# Altium schematic sheet SME_Main.SchDoc: Titulo
size OrCAD A; Author: Ismael Poblete V.; CompanyName: SME; Organization: SME; Address1: Santiago, Chile; DocumentNumber: SME-UNO; Revision: 1.0; SheetNumber: 1; SheetTotal: 7
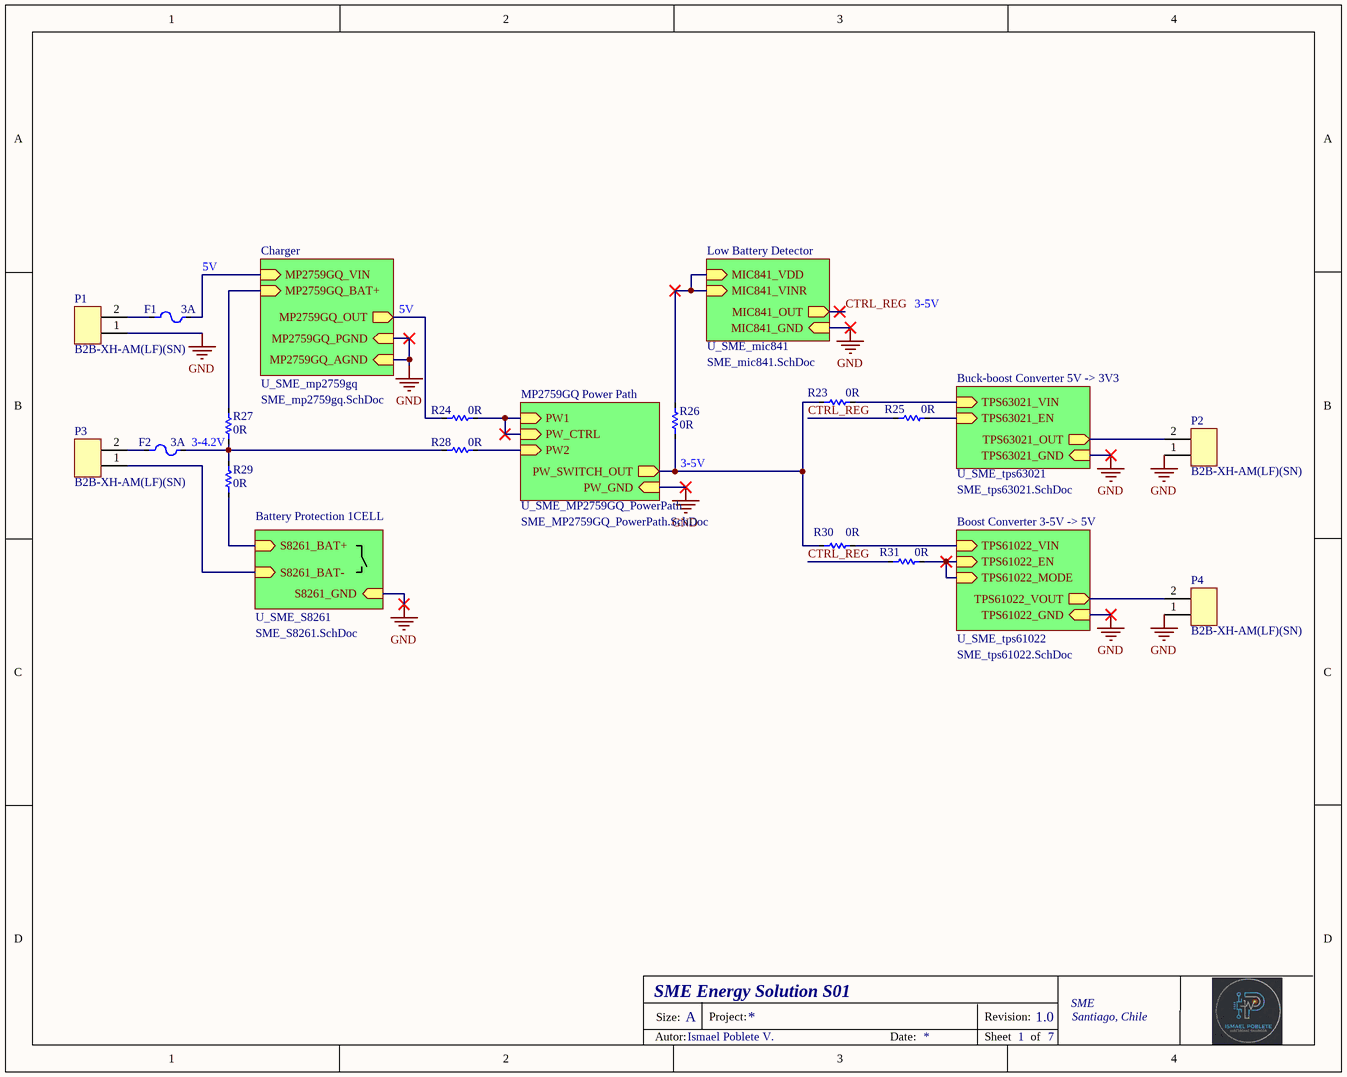
[diagram p0: SME_Main.SchDoc]

## Parts
F1  Fuse value: 3A  [Fuse 22.7mm - 2 Hole]  (hidden comment: FUSE - Littelfuse)
F2  Fuse value: 3A  [Fuse 22.7mm - 2 Hole]  (hidden comment: FUSE - Littelfuse)
P1  B2B-XH-AM(LF)(SN)  [2Pin JST XH-2.54mm]
P2  B2B-XH-AM(LF)(SN)  [2Pin JST XH-2.54mm]
P3  B2B-XH-AM(LF)(SN)  [2Pin JST XH-2.54mm]
P4  B2B-XH-AM(LF)(SN)  [2Pin JST XH-2.54mm]
R23  Resistance: 0R  [RES_1206]  (hidden comment: RC1206FR-070RL)
R24  Resistance: 0R  [RES_1206]  (hidden comment: RC1206FR-070RL)
R25  Resistance: 0R  [RES_1206]  (hidden comment: RC1206FR-070RL)
R26  Resistance: 0R  [RES_1206]  (hidden comment: RC1206FR-070RL)
R27  Resistance: 0R  [RES_1206]  (hidden comment: RC1206FR-070RL)
R28  Resistance: 0R  [RES_1206]  (hidden comment: RC1206FR-070RL)
R29  Resistance: 0R  [RES_1206]  (hidden comment: RC1206FR-070RL)
R30  Resistance: 0R  [RES_1206]  (hidden comment: RC1206FR-070RL)
R31  Resistance: 0R  [RES_1206]  (hidden comment: RC1206FR-070RL)

## Sub-sheets
U_SME_mic841 = SME_mic841.SchDoc: MIC841_VDD (in), MIC841_VINR (in), MIC841_OUT (out), MIC841_GND (in)
U_SME_mp2759gq = SME_mp2759gq.SchDoc: MP2759GQ_VIN (in), MP2759GQ_OUT (out), MP2759GQ_BAT+ (in), MP2759GQ_AGND (in), MP2759GQ_PGND (in)
U_SME_MP2759GQ_PowerPath = SME_MP2759GQ_PowerPath.SchDoc: PW_SWITCH_OUT (out), PW1 (in), PW2 (in), PW_CTRL (in), PW_GND (in)
U_SME_S8261 = SME_S8261.SchDoc: S8261_BAT+ (in), S8261_BAT- (in), S8261_GND (in)
U_SME_tps61022 = SME_tps61022.SchDoc: TPS61022_VIN (in), TPS61022_EN (in), TPS61022_MODE (in), TPS61022_VOUT (out), TPS61022_GND (in)
U_SME_tps63021 = SME_tps63021.SchDoc: TPS63021_VIN (in), TPS63021_OUT (out), TPS63021_EN (in), TPS63021_GND (in)

## Nets
GND: P1.1 P2.1 P4.1 ; sheet U_SME_mic841/MIC841_GND, sheet U_SME_S8261/S8261_GND, sheet U_SME_mp2759gq/MP2759GQ_AGND, sheet U_SME_mp2759gq/MP2759GQ_PGND, sheet U_SME_tps61022/TPS61022_GND, sheet U_SME_tps63021/TPS63021_GND, sheet U_SME_MP2759GQ_PowerPath/PW_GND
CTRL_REG: R25.1 R31.1 ; sheet U_SME_mic841/MIC841_OUT
NetF1_1: F1.1 P1.2
NetF1_2: F1.2 ; sheet U_SME_mp2759gq/MP2759GQ_VIN
NetF2_1: F2.1 P3.2
NetF2_2: F2.2 R27.1 R28.1 R29.2
NetP2_2: P2.2 ; sheet U_SME_tps63021/TPS63021_OUT
NetP3_1: P3.1 ; sheet U_SME_S8261/S8261_BAT-
NetP4_2: P4.2 ; sheet U_SME_tps61022/TPS61022_VOUT
NetR23_1: R23.1 R26.1 R30.1 ; sheet U_SME_MP2759GQ_PowerPath/PW_SWITCH_OUT
NetR23_2: R23.2 ; sheet U_SME_tps63021/TPS63021_VIN
NetR24_1: R24.1 ; sheet U_SME_mp2759gq/MP2759GQ_OUT
NetR24_2: R24.2 ; sheet U_SME_MP2759GQ_PowerPath/PW1, sheet U_SME_MP2759GQ_PowerPath/PW_CTRL
NetR25_2: R25.2 ; sheet U_SME_tps63021/TPS63021_EN
NetR26_2: R26.2 ; sheet U_SME_mic841/MIC841_VDD, sheet U_SME_mic841/MIC841_VINR
NetR27_2: R27.2 ; sheet U_SME_mp2759gq/MP2759GQ_BAT+
NetR28_2: R28.2 ; sheet U_SME_MP2759GQ_PowerPath/PW2
NetR29_1: R29.1 ; sheet U_SME_S8261/S8261_BAT+
NetR30_2: R30.2 ; sheet U_SME_tps61022/TPS61022_VIN
NetR31_2: R31.2 ; sheet U_SME_tps61022/TPS61022_EN, sheet U_SME_tps61022/TPS61022_MODE

## Notes on the sheet
- (near F1) 5V
- Charger
- Low Battery Detector
- 5V
- 3-5V
- MP2759GQ Power Path
- (near R25) Buck-boost Converter 5V -> 3V3
- (near R27) 3-4.2V
- (near R26) 3-5V
- (near R29) Battery Protection 1CELL
- (near R31) Boost Converter 3-5V -> 5V
- SME Energy Solution S01
- Size:
- A
- Project:
- Revision:
- Autor:
- Date:
- Sheet
- of

## Library data of the parts
F1 F2 = FUSE - Littelfuse: LITTELFUSE WICKMANN - 64600001003 - FUSE HOLDER, 5 X 20MM, PCB MOUNT; Material: Tin; Body Material: Polyamide; Color: Black; Illumination Type: Illuminated; Number of Circuits: 1; Voltage: 250V; Fuse Current: 6.3A; Type: thru-hole; Supplier 1: Digi-Key; Supplier Part Number 1: WK6244-ND; Manufacturer: Littelfuse Wickmann; Manufacturer Part Number: 64600001003; RoHS: Yes; Category: Fuse Holders; Stock 1: 1999; Pricing 1: 1=0.84000, 5=0.81200, 10=0.76000, 50=0.62880, 100=0.52400, 250=0.51092, 500=0.43230, 1000=0.37990, 5000=0.34060 (USD); Mount: Horizontal,PCB; Number of Pins: 2; Min Operating Temperature: -25°C; Max Operating Temperature: 70°C; Termination: PC Pin; Voltage Rating (DC): 250V; Voltage Rating (AC): 250V; Current Rating: 6.3A; Package Quantity: 1000; Voltage Rating: 250V; Number of Poles: 1; Packaging: Bulk; Length: 25.8mm; Depth: 5.5mm; Width: 12mm; Flammability Rating: UL94 V-1; REACH SVHC: Unknown; Lead Free: Lead Free; ComponentLink1URL: https://datasheet.ciiva.com/14119/gqlittelfuse-sicherungshalter-646-en-14119833.pdf?src-supplier=Distrelec; ComponentLink1Description: https://datasheet.ciiva.com/14119/gqlittelfuse-sicherungshalter-646-en-14119833.pdf?src-supplier=Distrelec; ComponentLink2URL: https://datasheet.ciiva.com/25620/0900766b81196eda-25620105.pdf?src-supplier=RSComponents; ComponentLink2Description: https://datasheet.ciiva.com/25620/0900766b81196eda-25620105.pdf?src-supplier=RSComponents; ComponentLink3URL: https://datasheet.ciiva.com/23593/43388-23593468.pdf?src-supplier=Newark; ComponentLink3Description: https://datasheet.ciiva.com/23593/43388-23593468.pdf?src-supplier=Newark; ComponentLink4URL: https://datasheet.ciiva.com/1270/1480080-1270114.pdf?src-supplier=Element14; ComponentLink4Description: https://datasheet.ciiva.com/1270/1480080-1270114.pdf?src-supplier=Element14; ComponentLink5URL: https://datasheet.ciiva.com/4480/646-648-640-lf-050901-4480295.pdf?src-supplier=Mouser; ComponentLink5Description: https://datasheet.ciiva.com/4480/646-648-640-lf-050901-4480295.pdf?src-supplier=Mouser; ComponentLink6URL: https://datasheet.ciiva.com/7660/646-648-640-lf-050901-7660727.pdf?src-supplier=Element14; ComponentLink6Description: https://datasheet.ciiva.com/7660/646-648-640-lf-050901-7660727.pdf?src-supplier=Element14; ComponentLink7URL: https://datasheet.ciiva.com/295/646-648-640-lf-050901-295754.pdf?src-supplier=Digi-Key; ComponentLink7Description: https://datasheet.ciiva.com/295/646-648-640-lf-050901-295754.pdf?src-supplier=Digi-Key; ComponentLink8URL: https://datasheet.ciiva.com/15187/getdatasheetpartid-57320-15187869.pdf?src-supplier=Verical; ComponentLink8Description: https://datasheet.ciiva.com/15187/getdatasheetpartid-57320-15187869.pdf?src-supplier=Verical; Package: 2 Pos
P1-P4 = B2B-XH-AM(LF)(SN): CONN HEADER VERT 2POS 2.5MM
R23-R31 = RC1206FR-070RL: Thick Film Resistors - SMD 0 Ohms 250 mW 1206 1%; Manufacturer_Name: Yageo Group; Geometry.Height: 0.65mm; Mouser Part Number: 603-RC1206FR-070RL; Mouser Price/Stock: https://www.mouser.co.uk/ProductDetail/YAGEO/RC1206FR-070RL?qs=%2FbpERZPLKKvgeF8VBtNQLg%3D%3D; Manufacturer_Part_Number: RC1206FR-070RL; Datasheet Link: https://www.yageogroup.com/content/datasheet/asset/file/PYU-RC_GROUP_51_ROHS_L; Case/Package: 1206; Manufacturer: Yageo Group; Package: 1206; Type: SMD; Manufacturer Part Number: RC1206FR-070RL